# Altium schematic sheet VoltageMonitor.SchDoc
size A4
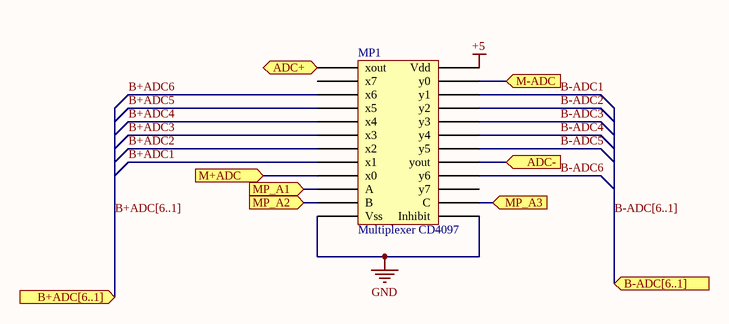
[diagram p0: VoltageMonitor.SchDoc]

## Parts
MP1  Multiplexer CD4097  [SOIC24]

## Ports
ADC+ (in), ADC- (in), B+ADC[6..1] (in), B-ADC[6..1] (in), M+ADC (in), M-ADC (in), MP_A1 (in), MP_A2 (in), MP_A3 (in)

## Nets
+5: MP1.Vdd
GND: MP1.Inhibit MP1.Vss
ADC+: MP1.xout ; port ADC+
ADC-: MP1.yout ; port ADC-
B+ADC1: MP1.x1
B+ADC2: MP1.x2
B+ADC3: MP1.x3
B+ADC4: MP1.x4
B+ADC5: MP1.x5
B+ADC6: MP1.x6
B-ADC1: MP1.y1
B-ADC2: MP1.y2
B-ADC3: MP1.y3
B-ADC4: MP1.y4
B-ADC5: MP1.y5
B-ADC6: MP1.y6
M+ADC: MP1.x0 ; port M+ADC
M-ADC: MP1.y0 ; port M-ADC
MP_A1: MP1.A ; port MP_A1
MP_A2: MP1.B ; port MP_A2
MP_A3: MP1.C ; port MP_A3

Not connected (* = marked no-connect by the designer): MP1 x7 y7

## Buses and harness runs
bus B+ADC[6..1] = port B+ADC[6..1]
bus B-ADC[6..1] = port B-ADC[6..1]

## Library data of the parts
MP1 = Multiplexer CD4097: pin to pad: A>10 B>11 C>14 Inhibit>13 Vdd>24 Vss>12 x0>9 x1>8 x2>7 x3>6 x4>5 x5>4 x6>3 x7>2 xout>1 y0>23 y1>22 y2>21 y3>20 y4>19 y5>18 y6>16 y7>15 yout>17